# EAGLE design Thermostaat (EAGLE 9.6.2)
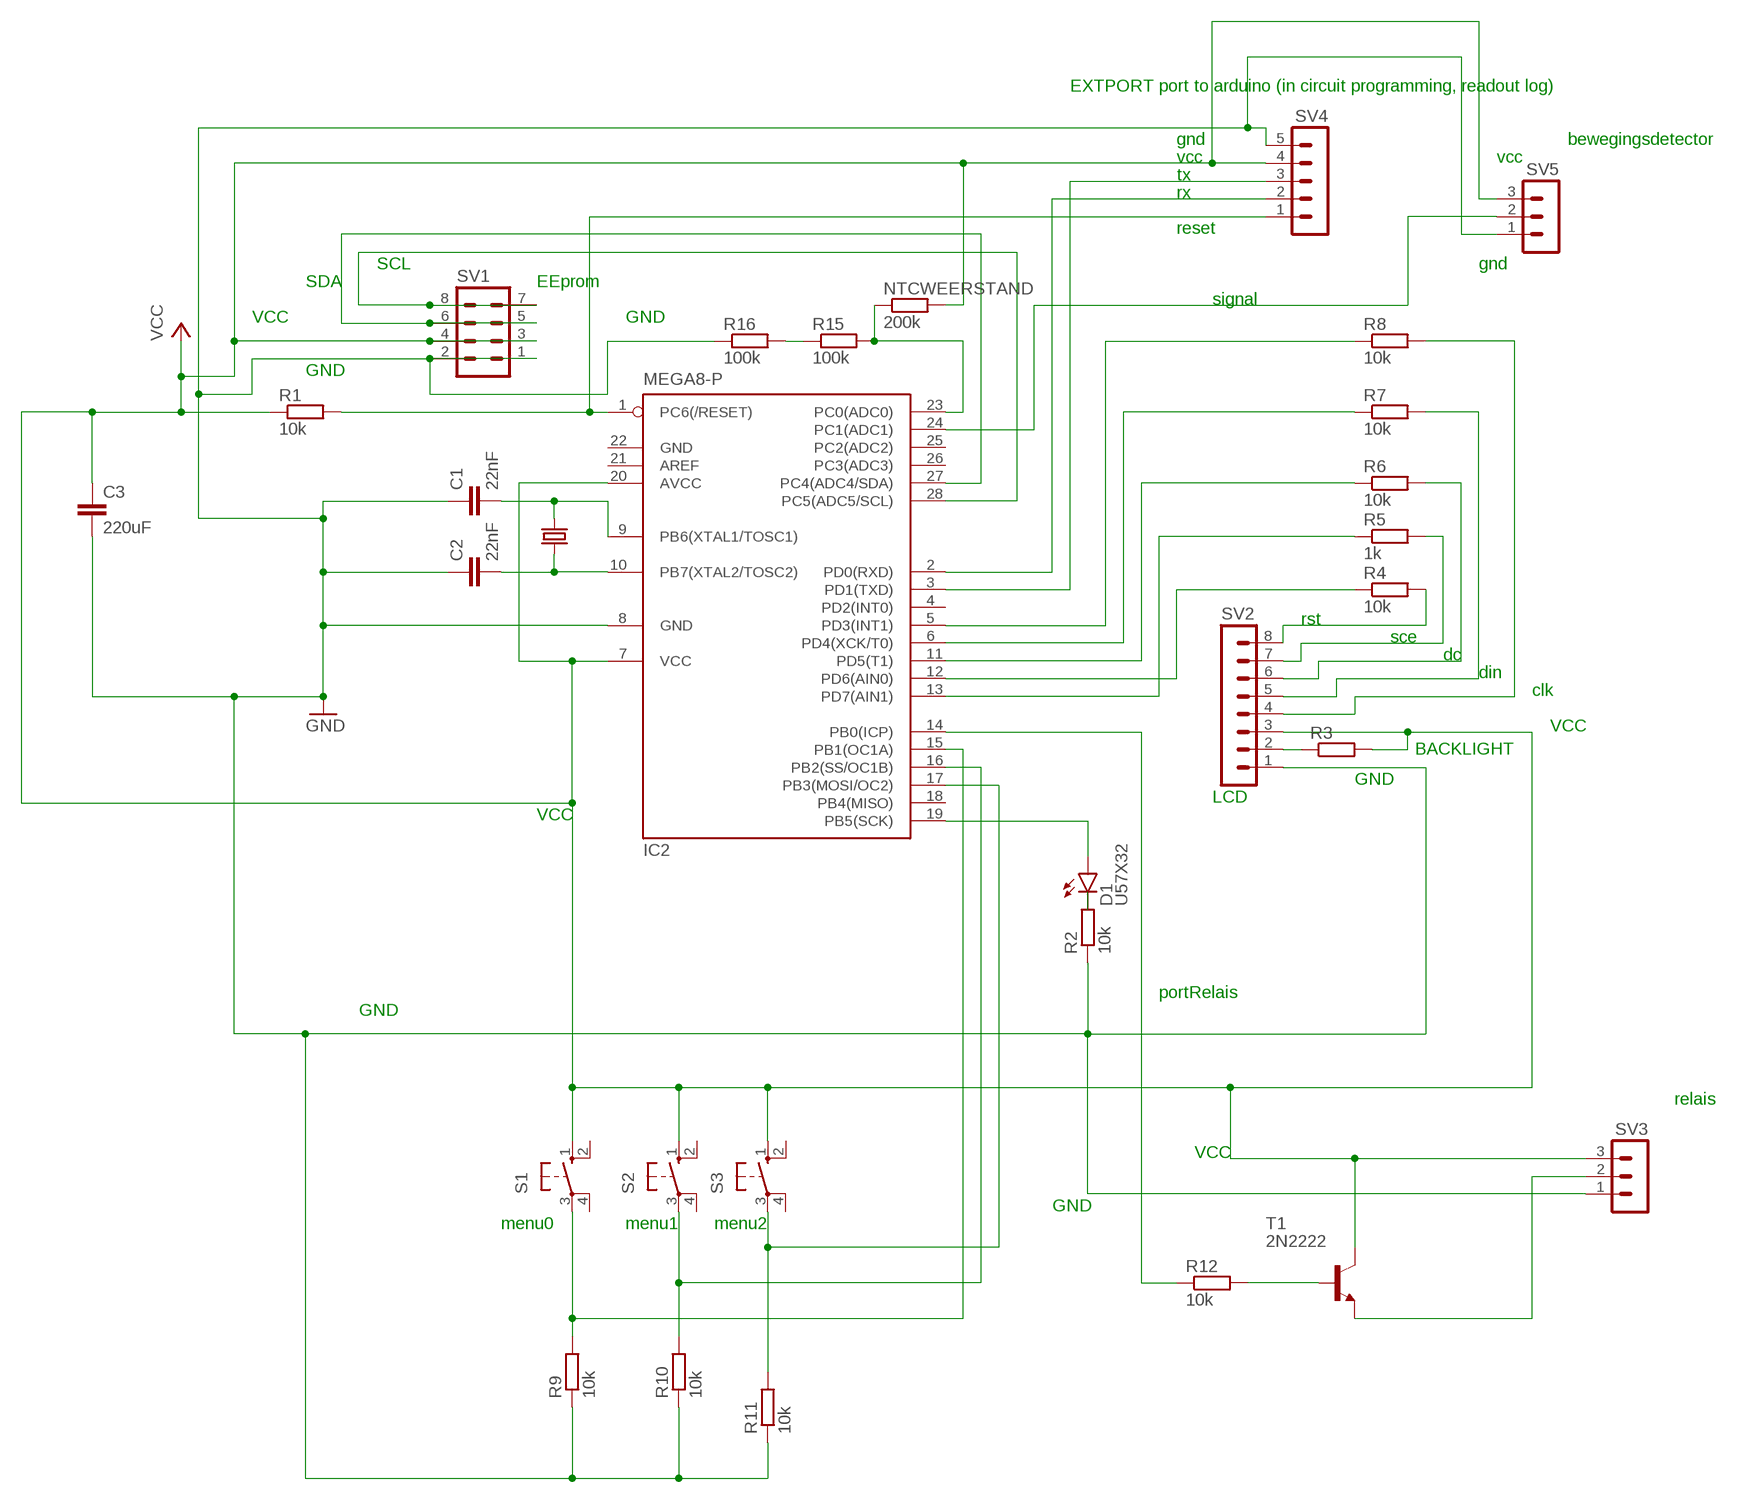
[diagram p0: schematic, sheet 1]

## Parts
C1  22nF  C2.5/2  [C2.5-2]
C2  22nF  C2.5/2  [C2.5-2]
C3  220uF  C5/5.5  [C5B5.5]
D1  U57X32  [U57X32]
IC2  MEGA8-P  [DIL28-3]
NTCWEERSTAND  200k  R-EU_0204/7  [0204/7]
Q1  CRYSTALHC49U-V  [HC49U-V]
R1  10k  R-EU_0204/7  [0204/7]
R2  10k  R-EU_0204/7  [0204/7]
R3  R-EU_0204/7  [0204/7]
R4  10k  R-EU_0204/7  [0204/7]
R5  1k  R-EU_0204/7  [0204/7]
R6  10k  R-EU_0204/7  [0204/7]
R7  10k  R-EU_0204/7  [0204/7]
R8  10k  R-EU_0204/7  [0204/7]
R9  10k  R-EU_0204/7  [0204/7]
R10  10k  R-EU_0204/7  [0204/7]
R11  10k  R-EU_0204/7  [0204/7]
R12  10k  R-EU_0204/7  [0204/7]
R15  100k  R-EU_0204/7  [0204/7]
R16  100k  R-EU_0204/7  [0204/7]
S1  10-XX  [B3F-10XX]
S2  10-XX  [B3F-10XX]
S3  10-XX  [B3F-10XX]
SV1  MA04-2  [MA04-2]
SV2  MA08-1  [MA08-1]
SV3  MA03-1  [MA03-1]
SV4  MA05-1  [MA05-1]
SV5  MA03-1  [MA03-1]
T1  2N2222  [TO18]

## Nets
GND: C1.1 C2.1 C3.2 IC2.8(GND) R2.1 R9.1 R10.1 R11.1 R16.1 SV1.1 SV1.2 SV2.1 SV3.1 SV4.5 SV5.1
N$1: IC2.1(PC6(/RESET)) R1.2 SV4.1
N$2: C2.2 IC2.10(PB7(XTAL2/TOSC2)) Q1.2
N$3: C1.2 IC2.9(PB6(XTAL1/TOSC1)) Q1.1
N$4: IC2.28(PC5(ADC5/SCL)) SV1.7 SV1.8
N$5: IC2.24(PC1(ADC1)) SV5.2
N$6: D1.A IC2.19(PB5(SCK))
N$7: D1.K(C) R2.2
N$8: R3.1 SV2.2
N$9: R8.2 SV2.4
N$10: R7.2 SV2.5
N$11: R6.2 SV2.6
N$12: R5.2 SV2.7
N$13: R4.2 SV2.8
N$14: IC2.5(PD3(INT1)) R8.1
N$15: IC2.6(PD4(XCK/T0)) R7.1
N$16: IC2.11(PD5(T1)) R6.1
N$17: IC2.13(PD7(AIN1)) R5.1
N$18: SV3.2 T1.1(E)
N$19: R12.2 T1.2(B)
N$20: IC2.14(PB0(ICP)) R12.1
N$22: IC2.12(PD6(AIN0)) R4.1
N$23: IC2.2(PD0(RXD)) SV4.2
N$24: IC2.3(PD1(TXD)) SV4.3
N$25: IC2.17(PB3(MOSI/OC2)) R11.2 S3.3(P)
N$26: IC2.16(PB2(SS/OC1B)) R10.2 S2.3(P)
N$27: IC2.15(PB1(OC1A)) R9.2 S1.3(P)
N$28: R15.1 R16.2
N$31: IC2.23(PC0(ADC0)) NTCWEERSTAND.1 R15.2
SCL: IC2.27(PC4(ADC4/SDA)) SV1.5 SV1.6
VCC: C3.1 IC2.7(VCC) IC2.20(AVCC) NTCWEERSTAND.2 R1.1 R3.2 S1.1(S) S2.1(S) S3.1(S) SV1.3 SV1.4 SV2.3 SV3.3 SV4.4 SV5.3 T1.3(C)
Unconnected: IC2.4(PD2(INT0)) IC2.18(PB4(MISO)) IC2.21(AREF) IC2.25(PC2(ADC2)) IC2.26(PC3(ADC3)) S1.2(S1) S1.4(P1) S2.2(S1) S2.4(P1) S3.2(S1) S3.4(P1)

## Notes on the sheet
- EXTPORT | port to arduino (in circuit programming, readout log)
- gnd | bewegingsdetector
- vcc | vcc
- tx
- rx
- reset
- SCL | gnd
- SDA | EEprom
- signal
- VCC | GND
- GND
- rst
- sce
- dc
- din
- clk
- VCC
- BACKLIGHT
- GND
- LCD
- VCC
- portRelais
- GND
- relais
- VCC
- GND
- menu0 | menu1 | menu2

## Power pins joined to a net without a drawn wire
GND: IC2.22(GND)

## Library data of the parts
C1-C3 = capacitor-wima:C: CAPACITOR naming: grid - package width
D1 = led:U57X32: LED rectangle, 5.7 x 3.2 mm
IC2 = atmel:MEGA8-P: MICROCONTROLLER 8 Kbytes FLASH, 1 kbytes SRAM, 512 bytes EEPROM, USART, 4-channel 10 bit ADC, 2-channel 8 bit ADC Pin compatible with Atmega48, ATMega88, ATMega168 Source: avr.lbr; OC_FARNELL: unknown; OC_NEWARK: unknown
NTCWEERSTAND R1-R12 R15 R16 = rcl:R-EU_: RESISTOR, European symbol; SPICEPREFIX: R
Q1 = crystal:CRYSTAL: CRYSTAL; OC_FARNELL: 1666969; OC_NEWARK: unknown
S1-S3 = switch-omron:10-XX: OMRON SWITCH; MPN: B3F-1000; OC_FARNELL: 176432; OC_NEWARK: 36M3542
SV1 = con-lstb:MA04-2: PIN HEADER; OC_FARNELL: unknown; OC_NEWARK: unknown
SV2 = con-lstb:MA08-1: PIN HEADER; OC_FARNELL: unknown; OC_NEWARK: unknown
SV3 SV5 = con-lstb:MA03-1: PIN HEADER; OC_FARNELL: unknown; OC_NEWARK: unknown
SV4 = con-lstb:MA05-1: PIN HEADER; OC_FARNELL: unknown; OC_NEWARK: unknown
T1 = transistor:2N2222: NPN TRANSISTOR

## Net classes
0 default: width 1.016 mm

## Board
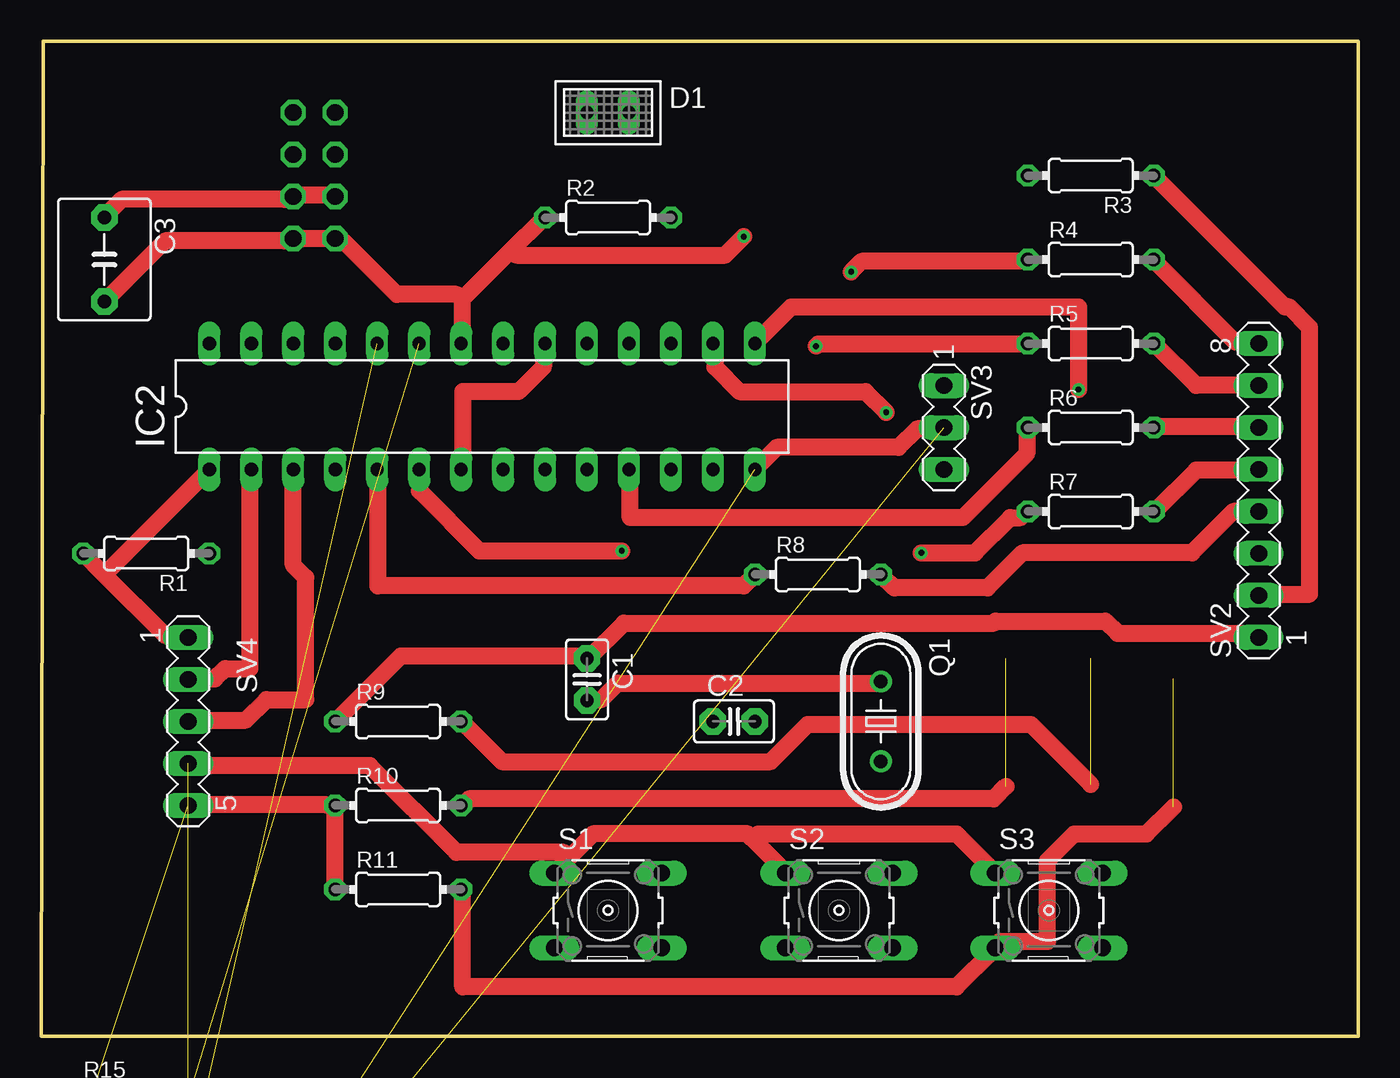
[diagram p1: board, top side]
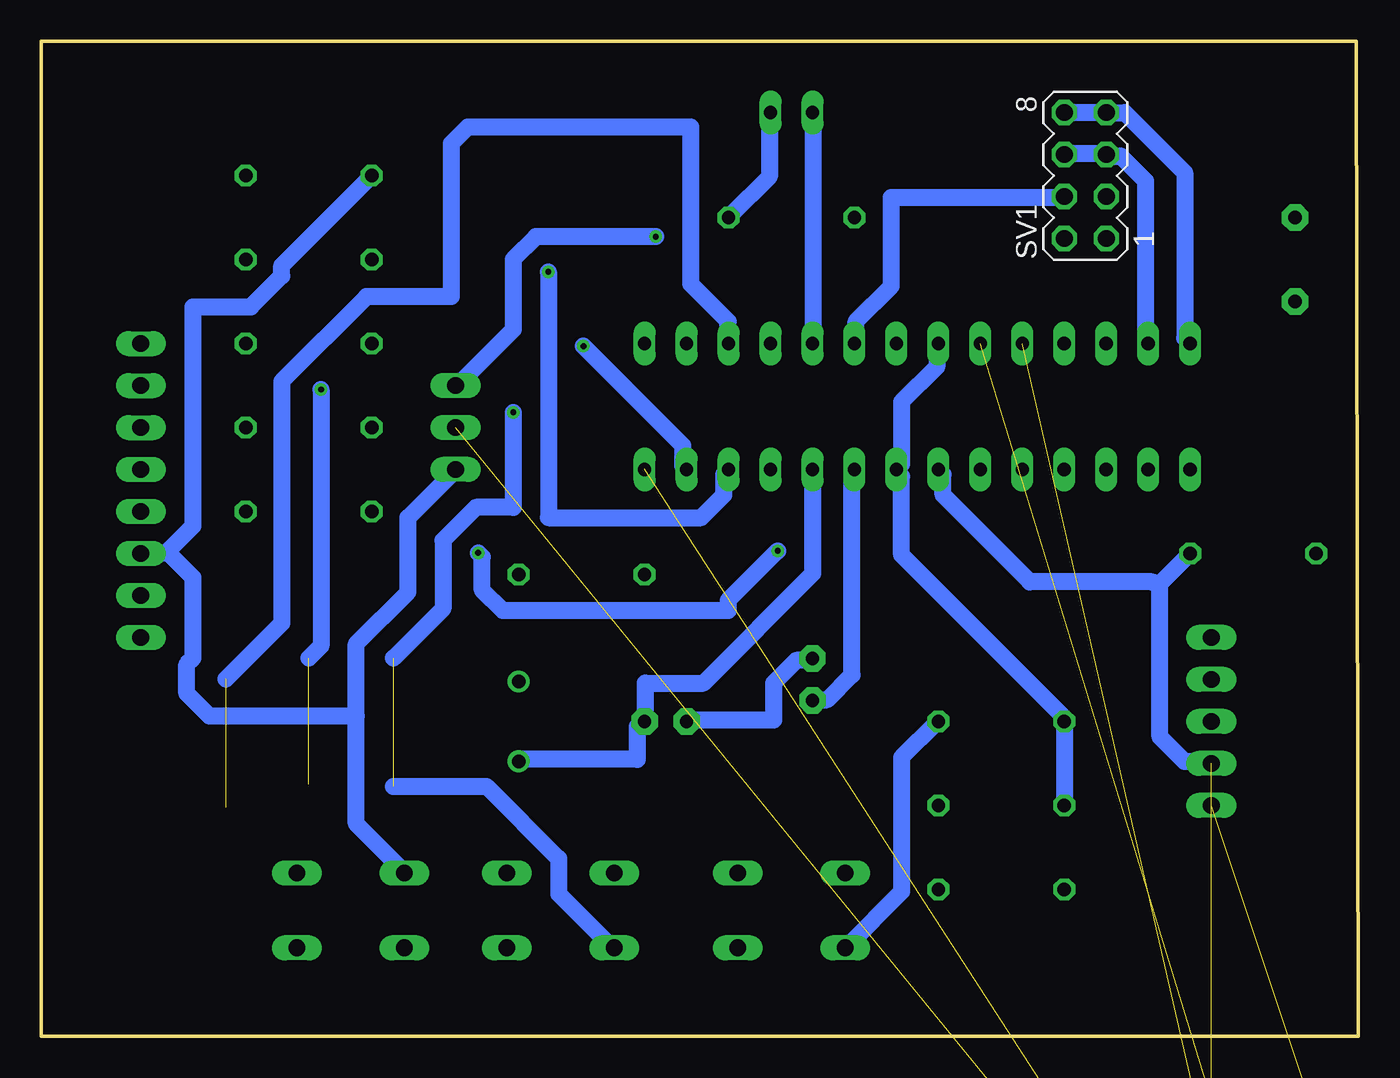
[diagram p2: board, bottom side, seen from below]

Size 79.68 x 60.19 mm. Coordinates in mm from the lower left corner, seen from the top.
Outline: 0,0 79.68,0 79.68,60.19 0.13,60.19 0,0
Copper layers (1*16): Top 0.035mm / dielectric 1.5mm / Bottom 0.035mm
Design rules "default *": minimum track width 0.2mm, minimum drill 0.35mm, track to track 6mil, track to pad 6mil, pad to pad 6mil, via to via 6mil, smd to smd 6mil, copper to edge 40mil, drill to drill 6mil, minimum pad ring 10mil, minimum via ring 8mil, stop-mask expansion 4mil, vias tented up to drill 0mil, thermal gap 10mil

### Footprints (pad centres in the part's own frame; a part is rotated, then mirrored left to right if it is on the bottom)
C2.5-2 = drill 0.813 pad 1.6 octagon: 1 -1.27,0; 2 1.27,0
C5B5.5 = drill 0.813 pad 1.6 octagon: 1 -2.54,0; 2 2.54,0
U57X32 = drill 0.813 long: A -1.27,0; K 1.27,0
DIL28-3 = drill 0.813 long: 1 -16.51,-3.81; 2 -13.97,-3.81; 3 -11.43,-3.81; 4 -8.89,-3.81; 5 -6.35,-3.81; 6 -3.81,-3.81; 7 -1.27,-3.81; 8 1.27,-3.81; 9 3.81,-3.81; 10 6.35,-3.81; 11 8.89,-3.81; 12 11.43,-3.81; 13 13.97,-3.81; 14 16.51,-3.81; 15 16.51,3.81; 16 13.97,3.81; 17 11.43,3.81; 18 8.89,3.81; 19 6.35,3.81; 20 3.81,3.81; 21 1.27,3.81; 22 -1.27,3.81; 23 -3.81,3.81; 24 -6.35,3.81; 25 -8.89,3.81; 26 -11.43,3.81; 27 -13.97,3.81; 28 -16.51,3.81
0204/7 = drill 0.813 octagon: 1 -3.81,0; 2 3.81,0
HC49U-V = drill 0.813: 1 -2.413,0; 2 2.413,0
B3F-10XX = drill 1.016 long: 1 -3.251,2.261; 2 3.251,2.261; 3 -3.251,-2.261; 4 3.251,-2.261
MA04-2 = drill 1.016 octagon: 1 -3.81,-1.27; 2 -3.81,1.27; 3 -1.27,-1.27; 4 -1.27,1.27; 5 1.27,-1.27; 6 1.27,1.27; 7 3.81,-1.27; 8 3.81,1.27
MA08-1 = drill 1.016 long: 1 -8.89,0; 2 -6.35,0; 3 -3.81,0; 4 -1.27,0; 5 1.27,0; 6 3.81,0; 7 6.35,0; 8 8.89,0
MA03-1 = drill 1.016 long: 1 -2.54,0; 2 0,0; 3 2.54,0
MA05-1 = drill 1.016 long: 1 -5.08,0; 2 -2.54,0; 3 0,0; 4 2.54,0; 5 5.08,0
TO18 = drill 0.813 octagon: 1 -1.27,-1.27; 2 1.27,-1.27; 3 1.27,1.27

### Placement (x,y rotation side)
C1  33.02,21.59 270 top
C2  41.91,19.05 0 top
C3  3.81,46.99 270 top
D1  34.29,55.88 0 top
IC2  26.67,38.1 0 top
NTCWEERSTAND  5.08,-13.97 0 top  (outside the outline)
Q1  50.8,19.05 270 top
R1  6.35,29.21 180 top
R2  34.29,49.53 0 top
R3  63.5,52.07 180 top
R4  63.5,46.99 0 top
R5  63.5,41.91 0 top
R6  63.5,36.83 0 top
R7  63.5,31.75 0 top
R8  46.99,27.94 0 top
R9  21.59,19.05 0 top
R10  21.59,13.97 0 top
R11  21.59,8.89 0 top
R12  5.08,-30.48 0 top  (outside the outline)
R15  5.08,-3.81 0 top  (outside the outline)
R16  5.08,-8.89 0 top  (outside the outline)
S1  34.29,7.62 0 top
S2  48.26,7.62 0 top
S3  60.96,7.62 0 top
SV1  16.51,52.07 90 bottom
SV2  73.66,33.02 90 top
SV3  54.61,36.83 270 top
SV4  8.89,19.05 270 top
SV5  6.35,-19.05 0 top  (outside the outline)
T1  5.08,-24.13 0 top  (outside the outline)

### Tracks (layer width: path | path; a pad name or v marks a point on that pad's centre or on a via)
GND  (via drill 0.35)  (2 unrouted)
  Top 1.016: C3.2 3.88,44.5 7.5,48.12 14.75,48.12 SV1.1 17.75,48.25 SV1.2 18.25,48.12 21.5,44.88 25.12,44.88 25.5,44.62 | 25.5,44.62 28.44,47.56 | 28.44,47.56 30.38,49.5 R2.1 | 25.5,44.62 25.5,42 IC2.22 | v42.5,48.38 41.38,47.25 28.75,47.25 28.44,47.56 | R11.1 17.75,9 17.75,13.88 R10.1 17.25,14 9,14 SV4.5 | SV2.1 73.62,24.25 73.5,24.38 65.12,24.38 64.38,25.12 57.75,25.12 57.62,25 35.25,25 33.12,22.88 C1.1 32.5,23 21.75,23 17.88,19.12 R9.1
  Bottom 1.016: IC2.22 25.5,41.88 25.5,40.5 27.62,38.38 27.62,34.62 27.88,34.38 IC2.8 27.62,33.88 27.62,29.12 18,19.5 R9.1 17.75,19 17.75,14 R10.1 | v42.5,48.38 49.75,48.38 51.12,47 51.12,42.75 54.5,39.38 SV3.1 | C2.1 40.62,19.12 35.38,19.12 35.38,21.38 34,22.75 33.12,22.75 C1.1
N$1
  Top 1.016: 3.81,27.94 7.5,24.25 8.88,24.25 SV4.1 | 3.81,27.94 R1.2 | 3.81,27.94 10.12,34.25 IC2.1
N$2
  Bottom 1.016: IC2.10 33,34.25 33,28 39.62,21.38 43.12,21.38 43.12,19.12 C2.2 43.62,18.75 43.62,16.75 50.75,16.75 Q1.2
N$3
  Top 1.016: Q1.1 50.75,21.38 34.88,21.38 33.88,20.38 33.12,20.38 C1.2
  Bottom 1.016: IC2.9 30.5,34.25 30.62,34.12 30.62,21.88 32.12,20.38 33,20.38 C1.2
N$4
  Bottom 1.016: IC2.28 10.5,42.25 10.5,52.25 14.12,55.88 15.12,55.88 SV1.7 15.62,55.88 17.75,55.88 SV1.8
N$5  (1 unrouted)
N$6
  Bottom 1.016: IC2.19 33,42 33,55.88 D1.A
N$7
  Bottom 1.016: R2.2 38,49.62 35.62,52 35.62,55.88 D1.K
N$8
  Top 1.016: R3.1 67.38,52 75.25,44.12 75.5,44.12 76.75,42.88 76.75,26.75 73.75,26.75 SV2.2
N$9
  Top 1.016: SV2.4 72.12,31.75 69.62,29.25 59.38,29.25 57.25,27.12 51.62,27.12 50.88,27.88 R8.2
N$10
  Top 1.016: R7.2 67.38,31.75 69.88,34.25 73.62,34.25 SV2.5
N$11
  Top 1.016: R6.2 67.38,36.88 73.62,36.88 SV2.6
N$12
  Top 1.016: R5.2 67.38,41.88 69.88,39.38 73.62,39.38 SV2.7
N$13
  Top 1.016: R4.2 67.38,46.88 72.25,42 73.62,42 SV2.8
N$14
  Top 1.016: IC2.5 20.38,34.25 20.38,27.25 42.5,27.25 43.12,27.88 R8.1
N$15  (via drill 0.35)
  Top 1.016: v53.25,29.25 56.5,29.25 58.62,31.38 59.25,31.38 59.62,31.75 R7.1 | v35.12,29.38 26.5,29.38 22.88,33 22.88,34.25 IC2.6
  Bottom 1.016: v53.25,29.25 53,29 53,27 51.75,25.75 38.12,25.75 38.12,26.38 v35.12,29.38
N$16
  Top 1.016: IC2.11 35.62,34.25 35.62,31.38 55.75,31.38 59.62,35.25 59.62,36.75 R6.1
N$17  (via drill 0.35)
  Top 1.016: v46.88,41.75 47,41.88 59.62,41.88 R5.1
  Bottom 1.016: v46.88,41.75 40.88,35.75 40.88,34.5 40.75,34.38 IC2.13
N$18  (1 unrouted)
N$19  (1 unrouted)
N$20  (1 unrouted)
  Top 1.016: 54.5,36.75 53,36.75 51.88,35.62 44.5,35.62 43.25,34.38 IC2.14
N$22  (via drill 0.35)
  Top 1.016: v49,46.25 49.62,46.88 59.62,46.88 R4.1
  Bottom 1.016: v49,46.25 49,31.38 39.75,31.38 38.38,32.75 38.38,34 38.12,34.25 IC2.12
N$23
  Top 1.016: IC2.2 12.62,34.25 12.62,22.25 11.12,22.25 10.5,21.62 9,21.62 SV4.2
N$24
  Top 1.016: IC2.3 15.25,34.25 15.25,28.5 16,27.75 16,20.38 13.62,20.38 12.38,19.12 9,19.12 SV4.3
N$25  (1 unrouted)
  Top 1.016: R11.2 25.5,8.88 25.5,3 55.38,3 57.62,5.25 S3.3 58,5.75 60.88,5.75 60.88,10.62 62.5,12.25 66.88,12.25 68.5,13.88
  Bottom 1.016: 68.5,21.62 65.12,25 65.12,39.62 60,44.75 54.88,44.75 54.88,54 53.88,55 40.38,55 40.38,45.5 38.12,43.25 38.12,42 IC2.17
N$26  (via drill 0.35)  (2 unrouted)
  Top 1.016: 58.38,15.12 57.62,14.38 25.88,14.38 25.5,14 R10.2 | v51.12,37.75 49.88,39 42.25,39 40.75,40.5 40.75,41.88 IC2.16
  Bottom 1.016: 58.38,15.12 52.75,15.12 48.38,10.75 48.38,8.62 45.12,5.38 S2.3 | 58.38,22.88 55.38,25.88 55.38,30 53.38,32 51.12,32 v51.12,37.75
N$27  (via drill 0.35)  (1 unrouted)
  Top 1.016: 63.5,15.25 59.88,18.88 46.38,18.88 44.12,16.62 27.88,16.62 25.5,19 R9.2 | v62.75,39.12 62.75,44.12 45.38,44.12 43.25,42 IC2.15
  Bottom 1.016: S1.3 31,5.38 27.62,8.75 27.62,16.88 25.5,19 R9.2 | 63.5,22.88 62.75,23.62 v62.75,39.12
N$28  (1 unrouted)
N$31  (2 unrouted)
SCL
  Bottom 1.016: IC2.27 12.75,42 12.88,42.12 12.88,51.75 14.38,53.25 15.12,53.25 SV1.5 15.75,53.38 17.75,53.38 SV1.6
VCC  (3 unrouted)
  Top 1.016: SV1.4 17.75,50.88 15.25,50.88 SV1.3 14.75,50.62 4.88,50.62 3.88,49.62 C3.1 | IC2.7 25.5,34.38 25.5,39 28.88,39 30.38,40.5 30.38,41.88 IC2.20 | 31.94,10.81 33.38,12.25 42.75,12.25 43.06,11.94 | 31.94,10.81 31.12,10 S1.1 | 43.06,11.94 45,10 S2.1 | S3.1 57.62,10 55.38,12.25 43.38,12.25 43.06,11.94 | SV4.4 9,16.5 9.12,16.38 19.88,16.38 25.12,11.12 31.62,11.12 31.94,10.81
  Bottom 1.016: 12,27.38 10.25,29.12 R1.1 | 12,27.38 12,18.12 10.5,16.62 9,16.62 SV4.4 | IC2.7 25.38,34.25 25.12,34 25.12,32.75 19.88,27.5 12.5,27.5 12,27.38 | SV1.4 17.88,50.75 28.25,50.75 28.25,45.38 30.38,43.25 30.38,42 IC2.20 | 72.06,29.31 72.12,29.25 73.62,29.25 SV2.3 | 72.06,29.31 70.5,30.88 70.5,44.12 67,44.12 65.12,46 65.12,46.62 59.75,52 R3.2 | 60.62,19.38 60.62,12.88 57.75,10 S3.1 | 60.62,19.38 60.62,23.75 57.5,26.88 57.5,31.38 54.62,34.25 SV3.3 | 72.06,29.31 70.5,27.75 70.5,22.88 70.88,22.5 70.88,20.75 69.5,19.38 60.62,19.38